# Altium schematic sheet ControllerPrint.SchDoc
size A4; SheetNumber: 1; SheetTotal: 2
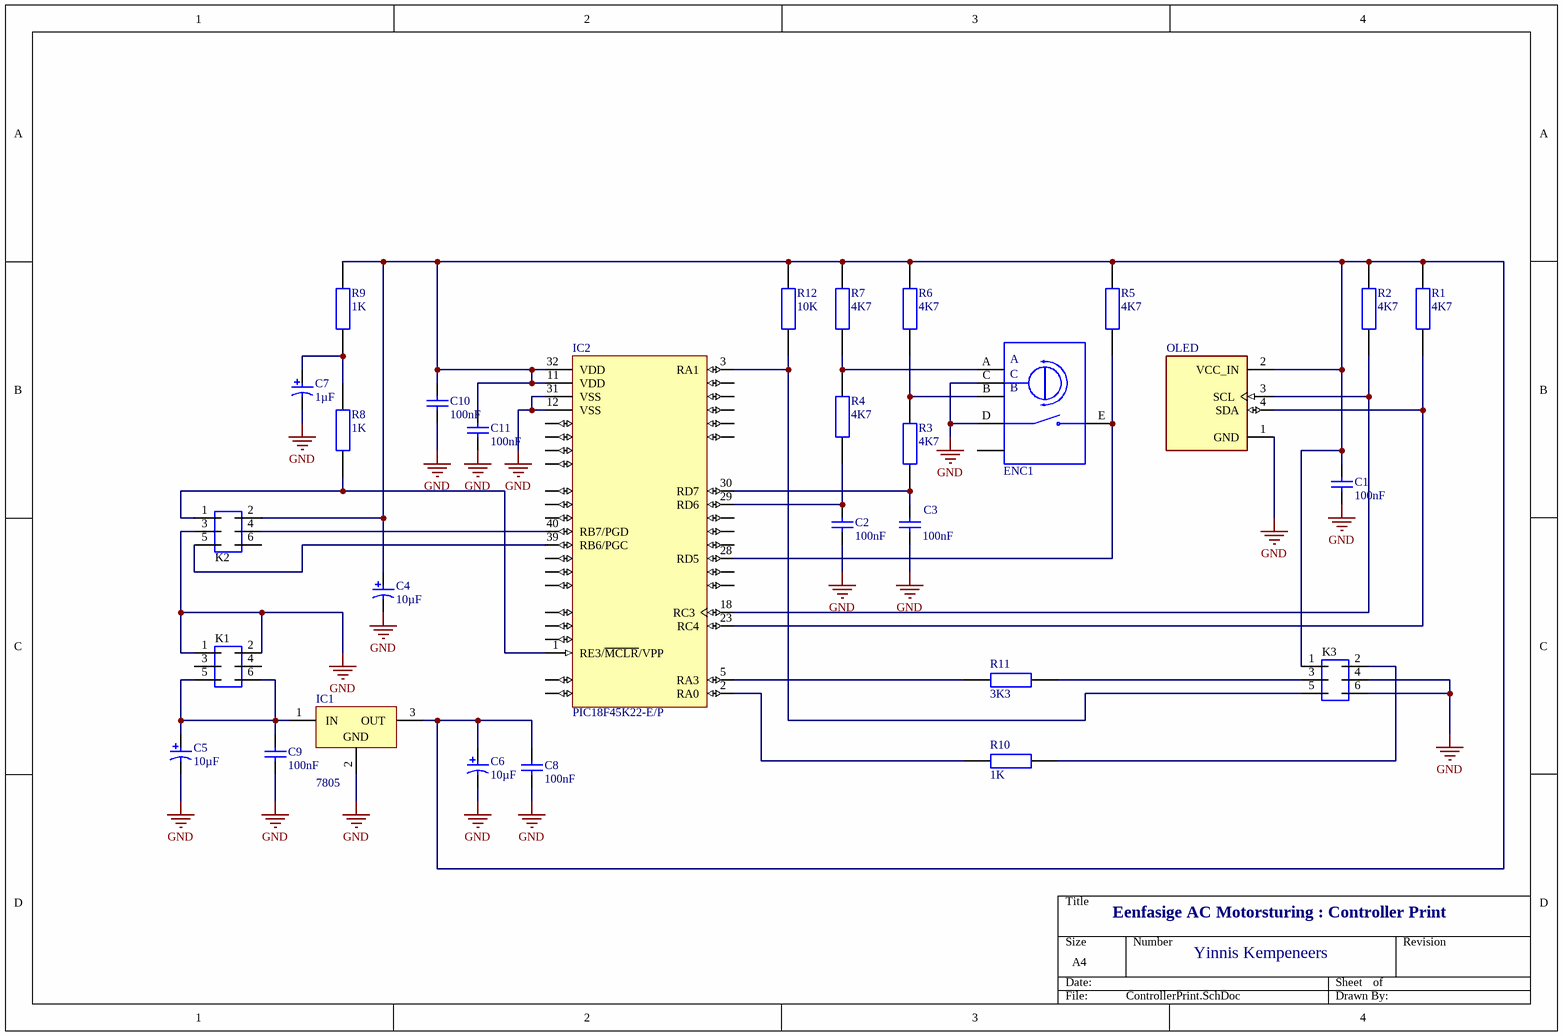
[diagram p0: ControllerPrint.SchDoc]

## Parts
C1  100nF  [Capacitor 100nF]
C2  100nF  [Capacitor 100nF]
C3  100nF  [Capacitor 100nF]
C4  10µF  [Capacitor 10µF]
C5  10µF  [Capacitor 10µF]
C6  10µF  [Capacitor 10µF]
C7  1µF  [Capacitor 10µF]
C8  100nF  [Capacitor 100nF]
C9  100nF  [Capacitor 100nF]
C10  100nF  [Capacitor 100nF]
C11  100nF  [Capacitor 100nF]
ENC1  EC12E2424407  [ENC1_PCB]  (value not drawn)
IC1  7805  [MC7805CTG]
IC2  PIC18F45K22-E/P  [PIC18F45K22-E/P]
K1  (no value)  [Pin3x2]
K2  TSW-103-08-L-D  [Pin3x2]  (value not drawn)
K3  TSW-103-08-L-D  [Pin3x2]  (value not drawn)
OLED  OLED  [OLED]  (value not drawn)
R1  4K7  [Resistor]
R2  4K7  [Resistor]
R3  4K7  [Resistor]
R4  4K7  [Resistor]
R5  4K7  [Resistor]
R6  4K7  [Resistor]
R7  4K7  [Resistor]
R8  1K  [Resistor]
R9  1K  [Resistor]
R10  1K  [Resistor]
R11  3K3  [Resistor]
R12  10K  [Resistor]

## Nets
GND: C1.1 C2.1 C3.1 C4.2 C5.2 C6.2 C7.2 C8.1 C9.1 C10.1 C11.1 ENC1.C ENC1.D(COM) IC1.2(GND) IC2.12(VSS) IC2.31(VSS) K1.1 K1.2 K2.3 K3.4 K3.6 OLED.1(GND)
NetC1_2: C1.2 C4.1 C6.1 C8.2 C10.2 C11.2 IC1.3(OUT) IC2.11(VDD) IC2.32(VDD) K2.2 K3.1 OLED.2(VCC_IN) R1.2 R2.2 R5.2 R6.2 R7.2 R9.2 R12.2
NetC2_2: C2.2 IC2.29(RD6) R4.1
NetC3_2: C3.2 IC2.30(RD7) R3.1
NetC5_1: C5.1 C9.2 IC1.1(IN) K1.5 K1.6
NetC7_1: C7.1 R8.2 R9.1
NetENC1_A: ENC1.A R4.2 R7.1
NetENC1_B: ENC1.B R3.2 R6.1
NetENC1_E: ENC1.E(NO) IC2.28(RD5) R5.1
NetENC1_S1: ENC1.S1(SHIELD) ENC1.S2(SHIELD)
NetIC2_1: IC2.1(RE3/~{MCLR}/VPP) K2.1 R8.1
NetIC2_2: IC2.2(RA0) R10.1
NetIC2_3: IC2.3(RA1) K3.5 R12.1
NetIC2_5: IC2.5(RA3) R11.1
NetIC2_18: IC2.18(RC3) OLED.3(SCL) R2.1
NetIC2_23: IC2.23(RC4) OLED.4(SDA) R1.1
NetIC2_39: IC2.39(RB6/PGC) K2.5
NetIC2_40: IC2.40(RB7/PGD) K2.4
NetK3_2: K3.2 R10.2
NetK3_3: K3.3 R11.2

Not connected (* = marked no-connect by the designer): IC2 4(RA2) 6(RA4) 7(RA5) 8(RE0) 9(RE1) 10(RE2) 13(RA7) 14(RA6) 15(RC0) 16(RC1) 17(RC2) 19(RD0) 20(RD1) 21(RD2) 22(RD3) 24(RC5) 25(RC6) 26(RC7) 27(RD4) 33(RB0) 34(RB1) 35(RB2) 36(RB3) 37(RB4) 38(RB5); K1 3 4; K2 6

## Notes on the sheet
- Eenfasige AC Motorsturing : Controller Print
- Yinnis Kempeneers

## Library data of the parts
C1-C3 C8-C11 = Capacitor 100nF: Radial Leaded Multilayer Ceramic Capacitor, 0.1 uF, +/- 10%, 50 V, -55 to 125 degC, 2-Pin THD, RoHS, Tape and Reel; Case\Package: SOT-23-5; Max Power Dissipation: 250 mW; Output Current: 150 mA; Dropout Voltage: 260 mV; Outputs: 1; Output Voltage: 5 V; Max Input Voltage: 8 V; Min Operating Temperature: -40 degC; Packaging: Tape and Reel; Height: 1.3 mm; Radiation Hardening: No; Pins: 5; ComponentLink1Description: Manufacturer URL; Mount: Surface Mount; RoHSCompliant: true; Max Operating Temperature: 85 degC; PackageReference: CAPR51-254-508X318X736; ComponentLink2URL: http://www.kemet.com/docfinder?Partnumber=C320C104K5R5TA; PackageDescription: 2-Pin Through Hole Device, Body 5.08 x 3.18 mm, Pitch 2.54 mm; ComponentLink1URL: http://www.kemet.com/; Width: 1.8 mm; Package Quantity: 3000; DatasheetVersion: Dec-15; Length: 3 mm; ComponentLink2Description: Datasheet
C4-C6 = Capacitor 10µF: Aluminum Electrolytic Capacitor, 10 uF, +/- 20%, 50 V, -40 to 85 degC, 2-Pin THD, RoHS, Bulk; Manufacturer: Panasonic; Life (Hours): 2000Hour; Lead/Base Style: Straight; Dissipation Factor: 0.12%; Capacitance: 10uF; Leakage Current: 3uA; Dielectric Material: Aluminium; Lead Diameter: 0.5mm; Voltage Rating: 50V; Ripple Current: 65mA; Package Reference: CAPPR55-200-1100X500X1200; Height: 11mm; Diameter: 5mm; REACH SVHC: NoSVHC; Mount: ThroughHole; Packaging: Bulk; Manufacturer URL: http://www.panasonic.com/; Termination: Radial; Datasheet URL: https://industrial.panasonic.com/cdbs/www-data/pdf/RDF0000/ABA0000C1218.pdf; Lead Free: LeadFree; Height - Seated (Max): 0.472inch; Case/Package: Radial; Package Description: 2-Pin Radial Lead, Dia 5 mm, Height 12 mm; Tolerance: 20%; Datasheet Version: Rev. 05, 10/2016; Package Quantity: 200; Ripple Current (AC): 65mA; Min Operating Temperature: -40degC; RoHSCompliant: true; Number of Pins: 2; Max Operating Temperature: 85degC; Voltage: 50V; Lead Pitch: 2mm; Radiation Hardening: No; Voltage Rating (DC): 50V; Length: 11mm
C7 = Capacitor 10µF: Aluminum 1µ Electrolytic Capacitor, 1 uF, +/- 20%, 50 V, -40 to 85 degC, 2-Pin THD, RoHS, Bulk; Manufacturer: Panasonic; Life (Hours): 2000Hour; Lead/Base Style: Straight; Dissipation Factor: 0.12%; Capacitance: 10uF; Leakage Current: 3uA; Dielectric Material: Aluminium; Lead Diameter: 0.5mm; Voltage Rating: 50V; Ripple Current: 65mA; Package Reference: CAPPR55-200-1100X500X1200; Height: 11mm; Diameter: 5mm; REACH SVHC: NoSVHC; Mount: ThroughHole; Packaging: Bulk; Manufacturer URL: http://www.panasonic.com/; Termination: Radial; Datasheet URL: https://industrial.panasonic.com/cdbs/www-data/pdf/RDF0000/ABA0000C1218.pdf; Lead Free: LeadFree; Height - Seated (Max): 0.472inch; Case/Package: Radial; Package Description: 2-Pin Radial Lead, Dia 5 mm, Height 12 mm; Tolerance: 20%; Datasheet Version: Rev. 05, 10/2016; Package Quantity: 200; Ripple Current (AC): 65mA; Min Operating Temperature: -40degC; RoHSCompliant: true; Number of Pins: 2; Max Operating Temperature: 85degC; Voltage: 50V; Lead Pitch: 2mm; Radiation Hardening: No; Voltage Rating (DC): 50V; Length: 11mm
ENC1 = ENC1: Encoders 12mm 24 Res 24 Dtent 20mm op sectn w/ sw; MF: ALPS; Price: None; SnapEDA_Link: https://www.snapeda.com/parts/EC12E2424407/ALPS/view-part/87294/?ref=snap; Availability: Unavailable; Package: None; MP: EC12E2424407; Value: *
IC1 = MC7805CTG: Positive Voltage Regulator, 1 A, 5 V, 0 to 125 degC, 3-Pin TO-220, RoHS, Tube; Manufacturer: ON Semiconductor; Resistance, Thermal, Junction to Case: 5degC/W; Voltage, Supply: 35V; Regulator Function: Standard; Temperature, Operating, Maximum: +125degC; Load Regulation: 25mV; Regulator Type: PositiveVoltageOut; Current, Output, Maximum: 1A; Regulation, Load: 1.3mV; Number of Outputs: 1; Temperature, Operating, Range: 0to+125degC; Regulation, Line: 0.5mV; Line Regulation: 20mV; Voltage, Input Range: Maximumof35V; Output Type: Fixed; Current, Quiescent Supply: 6.5mA; Dropout Voltage: 2V; Temperature, Operating, Minimum: 0degC; Package Version: Rev. A, 11/2010; Current, Supply: 3.2mA; Voltage, Output: 5V; Voltage, Noise: 10μV/V; Package Type: TO-220; Voltage, Input, High Level: 35V; Datasheet URL: http://www.onsemi.com/pub_link/Collateral/MC7800-D.PDF; Dimensions: 10.28x4.82x15.75mm; Width: 4.82mm; Type: VoltageRegulator; Mounting Type: ThroughHole; Polarity: Positive; Datasheet Version: Rev. 27, 11/2014; Height: 15.75mm; Dropout Voltage Measurement Current: 1A; Package Description: 3-Pin Flange Mount, Vertical Straight Lead, Body 9.97 x 4.445 mm, Pitch 2.54 mm; Manufacturer URL: http://www.onsemi.com/; Voltage, Dropout: 2V; Length: 10.28mm; Number of Pins: 3; Package Reference: TO-220-3-221AB-01
IC2 = PIC18F45K22-E/P: Low-Power, High-Performance Microcontroller with XLP Technology, 64 MHz, 35 I/O, -40 to 125 degC, 40-pin PDIP (P40), Tube; Manufacturer: Microchip; # of A/D Channels: 28; Max. CPU Speed MHz: 64; Operation Voltage Range: 2.3V - 5.5V; Timers: 3 - 8-bit, 4 - 16-bit; EEPROM Data Memory (bytes): 256; Internal Oscillator: 16 MHz, 31 kHz; Digital Communication: 2 -A/E/USART, 2 -MSSP(SPI/I2C); Memory Type: Flash; I/O Pins: 35; Program Memory KBytes: 32; RAM: 1536; Program Memory KWords: 16; ComponentLink1URL: http://ww1.microchip.com/downloads/en/DeviceDoc/41412F.pdf; ComponentLink2Description: Package Specification; Packing: TUBE; PackageReference: PDIP-P40; ComponentLink3Description: URL Link1; RoHS: TRUE; PartNumber: PIC18F45K22-E/P; DatasheetVersion: Rev. F; Mounting Technology: Through Hole; PackageVersion: C04-016B, 04/2013; PackageDescription: 40-Lead Plastic Dual In-Line Package, Body 51.75 x 13.53 mm, Pitch 2.54 mm; ComponentLink1Description: Datasheet; ComponentLink3URL: Product URL:http://www.microchip.com/datasheet/PIC18F45K22; ComponentLink2URL: http://www.microchip.com/stellent/groups/techpub_sg/documents/packagingspec/en012702.pdf
K1-K3 = Connector3x2: Male Header, Pitch 2.54 mm, 2 x 3 Position,  8.9 x 15.22 x 11.95 mm; Manufacturer: Samtec; DatasheetVersion: 04/2012; ComponentLink3URL: http://suddendocs.samtec.com/prints/tsw-xxx-xx-x-x-xx-xxx-footprint.pdf; PackageReference: TSW-103-08-L-D; Mounting Technology: Through Hole; Min Operating Temperature: -55 degC; ComponentLink2Description: Datasheet; Lead Pitch: 2.54 mm; ComponentLink1Description: Manufacturer URL; Mount: Through Hole; ComponentLink1URL: http://www.samtec.com/; ComponentLink3Description: Package Specification; Max Operating Temperature: 125 degC; PackageDescription: Male Header, Pitch 2.54 mm, 2 x 3 Position, Height 8.38 mm, Tail Length 5.08 mm; ComponentLink2URL: https://datasheet.ciiva.com/25618/0900766b81154476-25618436.pdf; RoHSCompliant: true
OLED = OLED: 0.96â€ 128 X 64 MONOCHROME GRAPHIC OLED DISPLAY MODULE - I2C; MP: DM-OLED096-636; SnapEDA_Link: https://www.snapeda.com/parts/DM-OLED096-636/Display+Module/view-part/?ref=snap; Package: Package; Value: *; MF: Display Module; Check_prices: https://www.snapeda.com/parts/DM-OLED096-636/Display+Module/view-part/?ref=eda
R1-R4 R6 R7 = Resistor: RES 4K7 OHM 0.6W 1% AXIAL; Power Rating: 600mW; Lead Diameter: 0.6mm; Voltage Rating (DC): 350V; Resistance: 1kR; Temperature Coefficient: 50ppm/°C; Width: 2.5mm; Military Standard: Not; Package Quantity: 5000; Radiation Hardening: No; Case/Package: Axial; Resistance Tolerance: 1%; Resistor Type: Metal Film; Contact Plating: Tin; Length: 6.5mm; Lead Free: Lead Free; RoHS Compliant: Yes; Mount: Through Hole; Number of Pins: 2; Technology: THIN FILM; Voltage Rating: 350V; Min Operating Temperature: -55°C; Weight: 0.00776oz; Diameter: 2.5mm; Construction: Cylindrical; Series: MRS25; Tolerance: 1%; Packaging: Tape and Reel; Max Operating Temperature: 155°C; Max Power Dissipation: 600mW; Number of Terminations: 2; Termination: Axial
R5 = Resistor: RES ?K OHM 0.6W 1% AXIAL; Power Rating: 600mW; Lead Diameter: 0.6mm; Voltage Rating (DC): 350V; Resistance: 1kR; Temperature Coefficient: 50ppm/°C; Width: 2.5mm; Military Standard: Not; Package Quantity: 5000; Radiation Hardening: No; Case/Package: Axial; Resistance Tolerance: 1%; Resistor Type: Metal Film; Contact Plating: Tin; Length: 6.5mm; Lead Free: Lead Free; RoHS Compliant: Yes; Mount: Through Hole; Number of Pins: 2; Technology: THIN FILM; Voltage Rating: 350V; Min Operating Temperature: -55°C; Weight: 0.00776oz; Diameter: 2.5mm; Construction: Cylindrical; Series: MRS25; Tolerance: 1%; Packaging: Tape and Reel; Max Operating Temperature: 155°C; Max Power Dissipation: 600mW; Number of Terminations: 2; Termination: Axial
R8-R10 = Resistor: RES 1K OHM 0.6W 1% AXIAL; Power Rating: 600mW; Lead Diameter: 0.6mm; Voltage Rating (DC): 350V; Resistance: 1kR; Temperature Coefficient: 50ppm/°C; Width: 2.5mm; Military Standard: Not; Package Quantity: 5000; Radiation Hardening: No; Case/Package: Axial; Resistance Tolerance: 1%; Resistor Type: Metal Film; Contact Plating: Tin; Length: 6.5mm; Lead Free: Lead Free; RoHS Compliant: Yes; Mount: Through Hole; Number of Pins: 2; Technology: THIN FILM; Voltage Rating: 350V; Min Operating Temperature: -55°C; Weight: 0.00776oz; Diameter: 2.5mm; Construction: Cylindrical; Series: MRS25; Tolerance: 1%; Packaging: Tape and Reel; Max Operating Temperature: 155°C; Max Power Dissipation: 600mW; Number of Terminations: 2; Termination: Axial
R11 = Resistor: RES 3K3 OHM 0.6W 1% AXIAL; Power Rating: 600mW; Lead Diameter: 0.6mm; Voltage Rating (DC): 350V; Resistance: 1kR; Temperature Coefficient: 50ppm/°C; Width: 2.5mm; Military Standard: Not; Package Quantity: 5000; Radiation Hardening: No; Case/Package: Axial; Resistance Tolerance: 1%; Resistor Type: Metal Film; Contact Plating: Tin; Length: 6.5mm; Lead Free: Lead Free; RoHS Compliant: Yes; Mount: Through Hole; Number of Pins: 2; Technology: THIN FILM; Voltage Rating: 350V; Min Operating Temperature: -55°C; Weight: 0.00776oz; Diameter: 2.5mm; Construction: Cylindrical; Series: MRS25; Tolerance: 1%; Packaging: Tape and Reel; Max Operating Temperature: 155°C; Max Power Dissipation: 600mW; Number of Terminations: 2; Termination: Axial
R12 = Resistor: RES 10K OHM 0.6W 1% AXIAL; Power Rating: 600mW; Lead Diameter: 0.6mm; Voltage Rating (DC): 350V; Resistance: 1kR; Temperature Coefficient: 50ppm/°C; Width: 2.5mm; Military Standard: Not; Package Quantity: 5000; Radiation Hardening: No; Case/Package: Axial; Resistance Tolerance: 1%; Resistor Type: Metal Film; Contact Plating: Tin; Length: 6.5mm; Lead Free: Lead Free; RoHS Compliant: Yes; Mount: Through Hole; Number of Pins: 2; Technology: THIN FILM; Voltage Rating: 350V; Min Operating Temperature: -55°C; Weight: 0.00776oz; Diameter: 2.5mm; Construction: Cylindrical; Series: MRS25; Tolerance: 1%; Packaging: Tape and Reel; Max Operating Temperature: 155°C; Max Power Dissipation: 600mW; Number of Terminations: 2; Termination: Axial